# EasyEDA schematic Uno Hat.json
TITLE: Sheet_1; REV: 1.0; Date: 2020-10-20; Sheet: 1/1; Drawn By: Flamingo0001; Company: Your Company
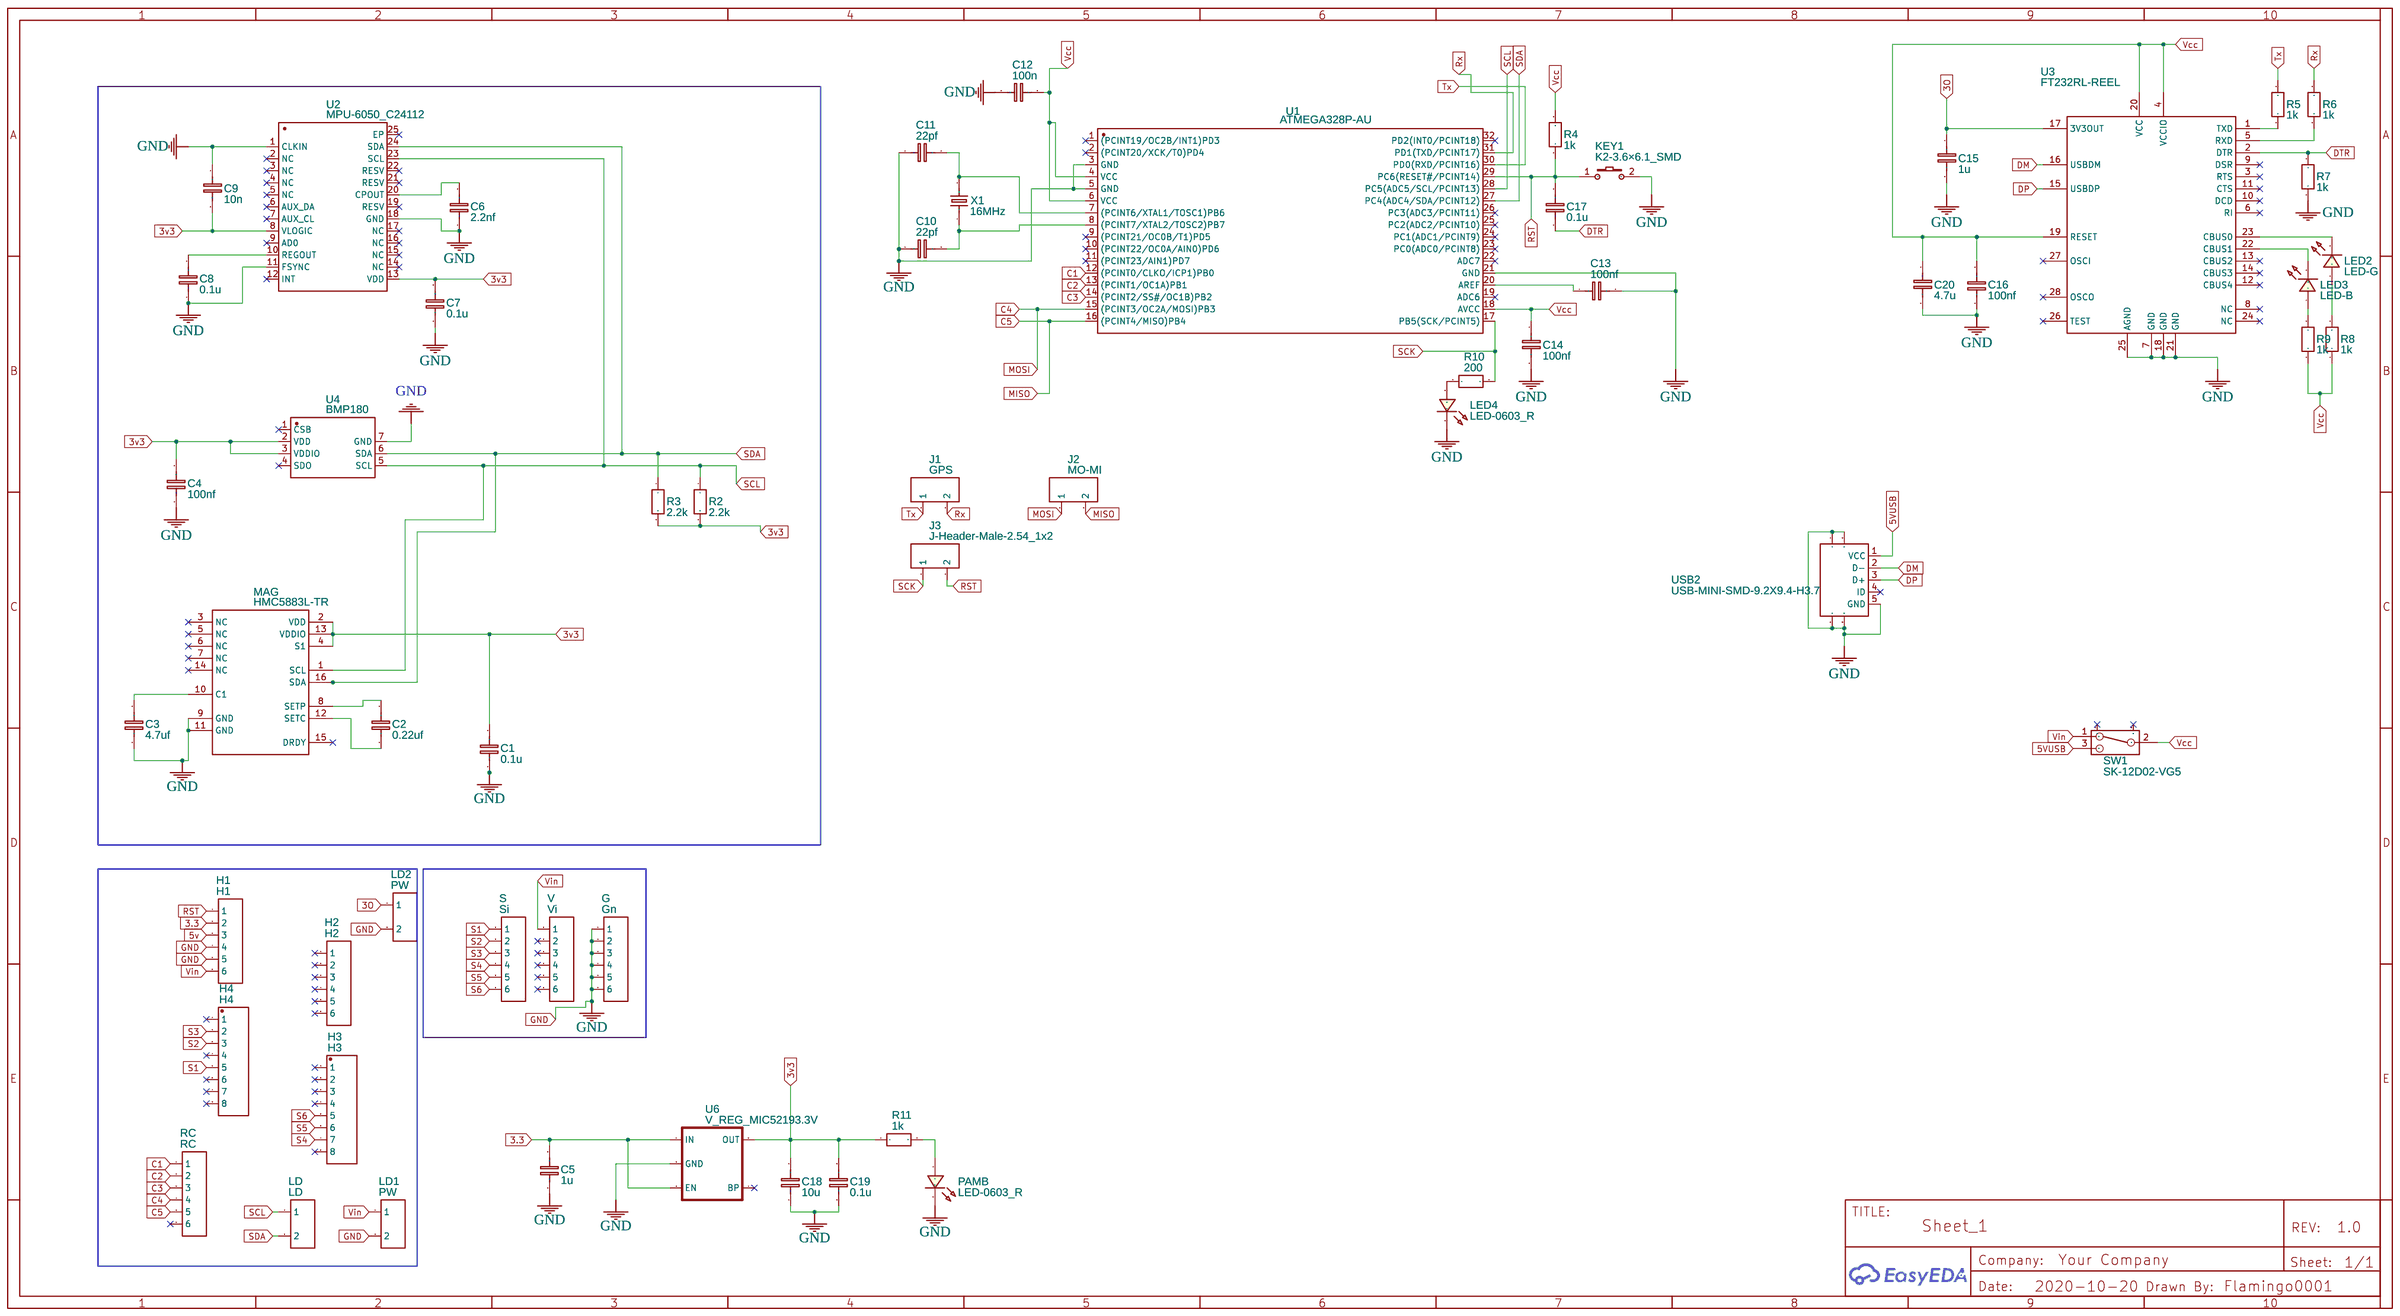
[diagram p0: schematic sheet]

## Parts
C1  0.1u  [C0603]
C2  0.22uf  [C0603]
C3  4.7uf  [C0603]
C4  100nf  [C0603]
C5  1u  [C0603]
C6  2.2nf  [C0603]
C7  0.1u  [C0603]
C8  0.1u  [C0603]
C9  10n  [C0603]
C10  22pf  [C0603]
C11  22pf  [C0603]
C12  100n  [C0603]
C13  100nf  [C0603]
C14  100nf  [C0603]
C15  1u  [C0603]
C16  100nf  [C0603]
C17  0.1u  [C0603]
C18  10u  [C0603]
C19  0.1u  [C0603]
C20  4.7u  [C0603]
G  Gn  [HDR-TH_6P-P2.54-V]
H1  H1  [HDR-TH_6P-P2.54-V]
H2  H2  [HDR-TH_6P-P2.54-V]
H3  H3  [HDR-TH_8P-P2.54-V-M]
H4  H4  [HDR-TH_8P-P2.54-V-M]
J1  GPS  [HDR-2X1/2.54]
J2  MO-MI  [HDR-2X1/2.54]
J3  J-Header-Male-2.54_1x2  [HDR-2X1/2.54]
KEY1  K2-3.6×6.1_SMD  [KEY-SMD_2P-L6.2-W3.6-LS8.0]
LD  LD  [HDR-TH_2P-P2.54-V]
LD1  PW  [HDR-TH_2P-P2.54-V]
LD2  PW  [HDR-TH_2P-P2.54-V]
LED2  LED-G  [LED0603_GREEN]
LED3  LED-B  [LED0603_BLUE]
LED4  LED-0603_R  [LED0603_RED]
MAG  HMC5883L-TR  [LPCC-16_L3.0-W3.0-P0.50-BL]
PAMB  LED-0603_R  [LED0603_RED]
R2  2.2k  [R0603]
R3  2.2k  [R0603]
R4  1k  [R0603]
R5  1k  [R0603]
R6  1k  [R0603]
R7  1k  [R0603]
R8  1k  [R0603]
R9  1k  [R0603]
R10  200  [R0603]
R11  1k  [R0603]
RC  RC  [HDR-TH_6P-P2.54-V]
S  Si  [HDR-TH_6P-P2.54-V]
SW1  SK-12D02-VG5  [SW-TH_SK-12D02VG3]
U1  ATMEGA328P-AU  [TQFP-32_L7.0-W7.0-P0.80-LS9.0-BL]
U2  MPU-6050_C24112  [QFN-24_L4.0-W4.0-P0.50-BL-EP2.6]
U3  FT232RL-REEL  [SSOP-28_L10.2-W5.3-P0.65-LS7.8-BL]
U4  BMP180  [LGA-7_L3.8-W3.6-P1.50-BL]
U6  V_REG_MIC52193.3V  [SOT23-5]
USB2  USB-MINI-SMD-9.2X9.4-H3.7  [MINI-USB-SMD_C105424]
V  Vi  [HDR-TH_6P-P2.54-V]
X1  16MHz  [HC-49US_L11.5-W4.5-P4.88]

## Library data of the parts
C1-C20 = C_0603_EU: Contributor: LCEDA_Lib
G H1 H2 RC S V = Header-Male-2.54_1x6: Supplier: LCSC; Manufacturer: BOOMELE; Supplier Part: C37208
H3 H4 = Header-Male-2.54_1x8: Supplier: LCSC; Manufacturer: Ckmtw; Manufacturer Part: 210S-1*8P L=11.6MMGold-plated black; Contributor: LCSC; Supplier Part: C124381
J1-J3 = J-Header-Male-2.54_1x2: Supplier Part: C86471; Supplier: LCSC; Manufacturer: TE Connectivity; Manufacturer Part: 826629-2; image: //image.lceda.cn/szlcsc/C86471.jpg; link: //image.lceda.cn/szlcsc/C86471.jpg
KEY1 = K2-3.6×6.1_SMD: Supplier Part: C118141; Supplier: LCSC; Manufacturer Part: K2-1107ST-A4SW-06; Contributor: LCEDA_Lib; 制造商: 韩国韩荣
LD LD1 LD2 = Header-Male-2.54_1x2: Supplier: LCSC; Manufacturer: TE Connectivity; Manufacturer Part: 826629-2; image: //image.lceda.cn/szlcsc/C86471.jpg; Supplier Part: C86471
LED2 = LED-0603_G: Manufacturer: EVERLIGHT(台湾亿光); Manufacturer Part: 19-217/GHC-YR1S2/3T; Supplier Part: C72043; Supplier: LCSC; Contributor: LCEDA_Lib
LED3 = LED-0603_B: Manufacturer: EVERLIGHT(台湾亿光); Manufacturer Part: 19-217/BHC-ZL1M2RY/3T; Supplier Part: C72041; Supplier: LCSC; Contributor: LCEDA_01
LED4 PAMB = LED-0603_R: Manufacturer: EVERLIGHT(台湾亿光); Manufacturer Part: 19-217/R6C-AL1M2VY/3T; Supplier Part: C72044; Supplier: LCSC; Contributor: LCEDA_01
MAG = HMC5883L-TR: Supplier: LCSC; Manufacturer: Honeywell; Supplier Part: C15640
R2-R11 = R_0603_EU: Contributor: LCEDA_Lib
SW1 = SK-12D02-VG5: Supplier: LCSC; Supplier Part: C136722; Manufacturer: Rectangular Connectors - Contacts; Contributor: LCSC
U1 = ATMEGA328P-AU: Supplier: LCSC; Manufacturer: MICROCHIP; image: //image.lceda.cn/szlcsc/C14877.jpg; Supplier Part: C14877; LCSC Assembly: Yes; SMT Type: Basic
U2 = MPU-6050_C24112: sourceId: 1T5FDZYC8; Supplier: LCSC; Manufacturer: InvenSense; Manufacturer Part: MPU-6050; image: //image.lceda.cn/szlcsc/C24112.jpg; Supplier Part: C24112
U3 = FT232RL-REEL: Supplier: LCSC; Manufacturer: FTDI; LCSC Assembly: Yes; image: //image.lceda.cn/szlcsc/C8690.jpg; Supplier Part: C8690; SMT Type: Basic
U4 = BMP180: Supplier: LCSC; Supplier Part: C438474; Manufacturer: Bosch Sensortec; Contributor: LCSC
U6 = V_REG_MIC52193.3V: V_REG MIC5219; Contributor: SparkFun
USB2 = USB-MINI-SMD-9.2X9.4-H3.7: Supplier: LCSC; Supplier Part: C105424; Manufacturer: LCSC; Contributor: LCSC
X1 = XIHCELNANF-16MHZ: Supplier: LCSC; Supplier Part: C295075; Manufacturer: TAITIEN Elec; Contributor: LCSC

## Nets
3v3: C1.2 C4.2 C7.2 C9.2 C18.2 C19.2 MAG.2(VDD) MAG.4(S1) MAG.13(VDDIO) R2.2 R3.2 R11.1 U2.8(VLOGIC) U2.13(VDD) U4.2(VDD) U4.3(VDDIO) U6.5(OUT)
5v: H1.3
5VUSB: SW1.3 USB2.1(VCC)
GND: C1.1 C3.1 C4.1 C5.1 C6.1 C7.1 C8.1 C9.1 C10.1 C11.1 C12.1 C13.2 C14.2 C15.2 C16.1 C18.1 C19.1 C20.2 G.1 G.2 G.3 G.4 G.5 G.6 H1.4 H1.5 KEY1.2 LD1.2 LD2.2 LED4.2 MAG.9(GND) MAG.11(GND) PAMB.2 R7.1 U1.3(GND) U1.5(GND) U1.21(GND) U2.1(CLKIN) U2.11(FSYNC) U2.18(GND) U3.7(GND) U3.18(GND) U3.21(GND) U3.25(AGND) U4.7(GND) U6.2(GND) USB2.5(GND) USB2.6 USB2.7 USB2.8 USB2.9
Vcc: C12.2 C14.1 C16.2 C20.1 R4.2 R8.1 R9.1 SW1.2 U1.4(VCC) U1.6(VCC) U1.18(AVCC) U3.4(VCCIO) U3.19(RESET) U3.20(VCC)
Vin: H1.6 LD1.1 SW1.1 V.1
3.3: C5.2 H1.2 U6.1(IN) U6.3(EN)
3O: C15.1 LD2.1 U3.17(3V3OUT)
C1: RC.1 U1.12((PCINT0/CLKO/ICP1)PB0)
C2: RC.2 U1.13((PCINT1/OC1A)PB1)
C3: RC.3 U1.14((PCINT2/SS#/OC1B)PB2)
C4: J2.1 RC.4 U1.15((PCINT3/OC2A/MOSI)PB3)
C5: J2.2 RC.5 U1.16((PCINT4/MISO)PB4)
DM: U3.16(USBDM) USB2.2(D-)
DP: U3.15(USBDP) USB2.3(D+)
DTR: C17.1 R7.2 U3.2(DTR)
RST: C17.2 H1.1 J3.2 KEY1.1 R4.1 U1.29(PC6(RESET#/PCINT14))
Rx: J1.2 R6.2 U1.31(PD1(TXD/PCINT17))
S1: H4.5 S.1
S2: H4.3 S.2
S3: H4.2 S.3
S4: H3.7 S.4
S5: H3.6 S.5
S6: H3.5 S.6
SCK: J3.1 R10.2 U1.17(PB5(SCK/PCINT5))
SCL: LD.1 MAG.1(SCL) R2.1 U1.28(PC5(ADC5/SCL/PCINT13)) U2.23(SCL) U4.5(SCL)
SDA: LD.2 MAG.16(SDA) R3.1 U1.27(PC4(ADC4/SDA/PCINT12)) U2.24(SDA) U4.6(SDA)
Tx: J1.1 R5.2 U1.30(PD0(RXD/PCINT16))
Net-(C2-1): C2.1 MAG.12(SETC)
Net-(C2-2): C2.2 MAG.8(SETP)
Net-(C3-2): C3.2 MAG.10(C1)
Net-(C6-2): C6.2 U2.20(CPOUT)
Net-(C8-2): C8.2 U2.10(REGOUT)
Net-(C10-2): C10.2 U1.8((PCINT7/XTAL2/TOSC2)PB7) X1.1
Net-(C11-2): C11.2 U1.7((PCINT6/XTAL1/TOSC1)PB6) X1.2
Net-(C13-1): C13.1 U1.20(AREF)
Net-(LED2-1): LED2.1 R8.2
Net-(LED2-2): LED2.2 U3.23(CBUS0)
Net-(LED3-1): LED3.1 R9.2
Net-(LED3-2): LED3.2 U3.22(CBUS1)
Net-(LED4-1): LED4.1 R10.1
Net-(PAMB-1): PAMB.1 R11.2
Net-(R5-1): R5.1 U3.1(TXD)
Net-(R6-1): R6.1 U3.5(RXD)

Not connected (* = marked no-connect by the designer): H2 1* 2* 3* 4* 5* 6*; H3 1* 2* 3* 4* 8*; H4 1* 4* 6* 7* 8*; MAG 3(NC)* 5(NC)* 6(NC)* 7(NC)* 14(NC)* 15(DRDY)*; RC 6*; SW1 4* 5*; U1 1((PCINT19/OC2B/INT1)PD3)* 2((PCINT20/XCK/T0)PD4)* 9((PCINT21/OC0B/T1)PD5)* 10((PCINT22/OC0A/AIN0)PD6)* 11((PCINT23/AIN1)PD7)* 19(ADC6)* 22(ADC7)* 23(PC0(ADC0/PCINT8))* 24(PC1(ADC1/PCINT9))* 25(PC2(ADC2/PCINT10))* 26(PC3(ADC3/PCINT11))* 32(PD2(INT0/PCINT18))*; U2 2(NC)* 3(NC)* 4(NC)* 5(NC)* 6(AUX_DA)* 7(AUX_CL)* 9(AD0)* 12(INT)* 14(NC)* 15(NC)* 16(NC)* 17(NC)* 19(RESV)* 21(RESV)* 22(RESV)* 25(EP)*; U3 3(RTS)* 6(RI)* 8(NC)* 9(DSR)* 10(DCD)* 11(CTS)* 12(CBUS4)* 13(CBUS2)* 14(CBUS3)* 24(NC)* 26(TEST)* 27(OSCI)* 28(OSCO)*; U4 1(CSB)* 4(SDO)*; U6 4(BP)*; USB2 4(ID)*; V 2* 3* 4* 5* 6*
